# EAGLE schematic CM3+IO Board (EAGLE 9.5.2)
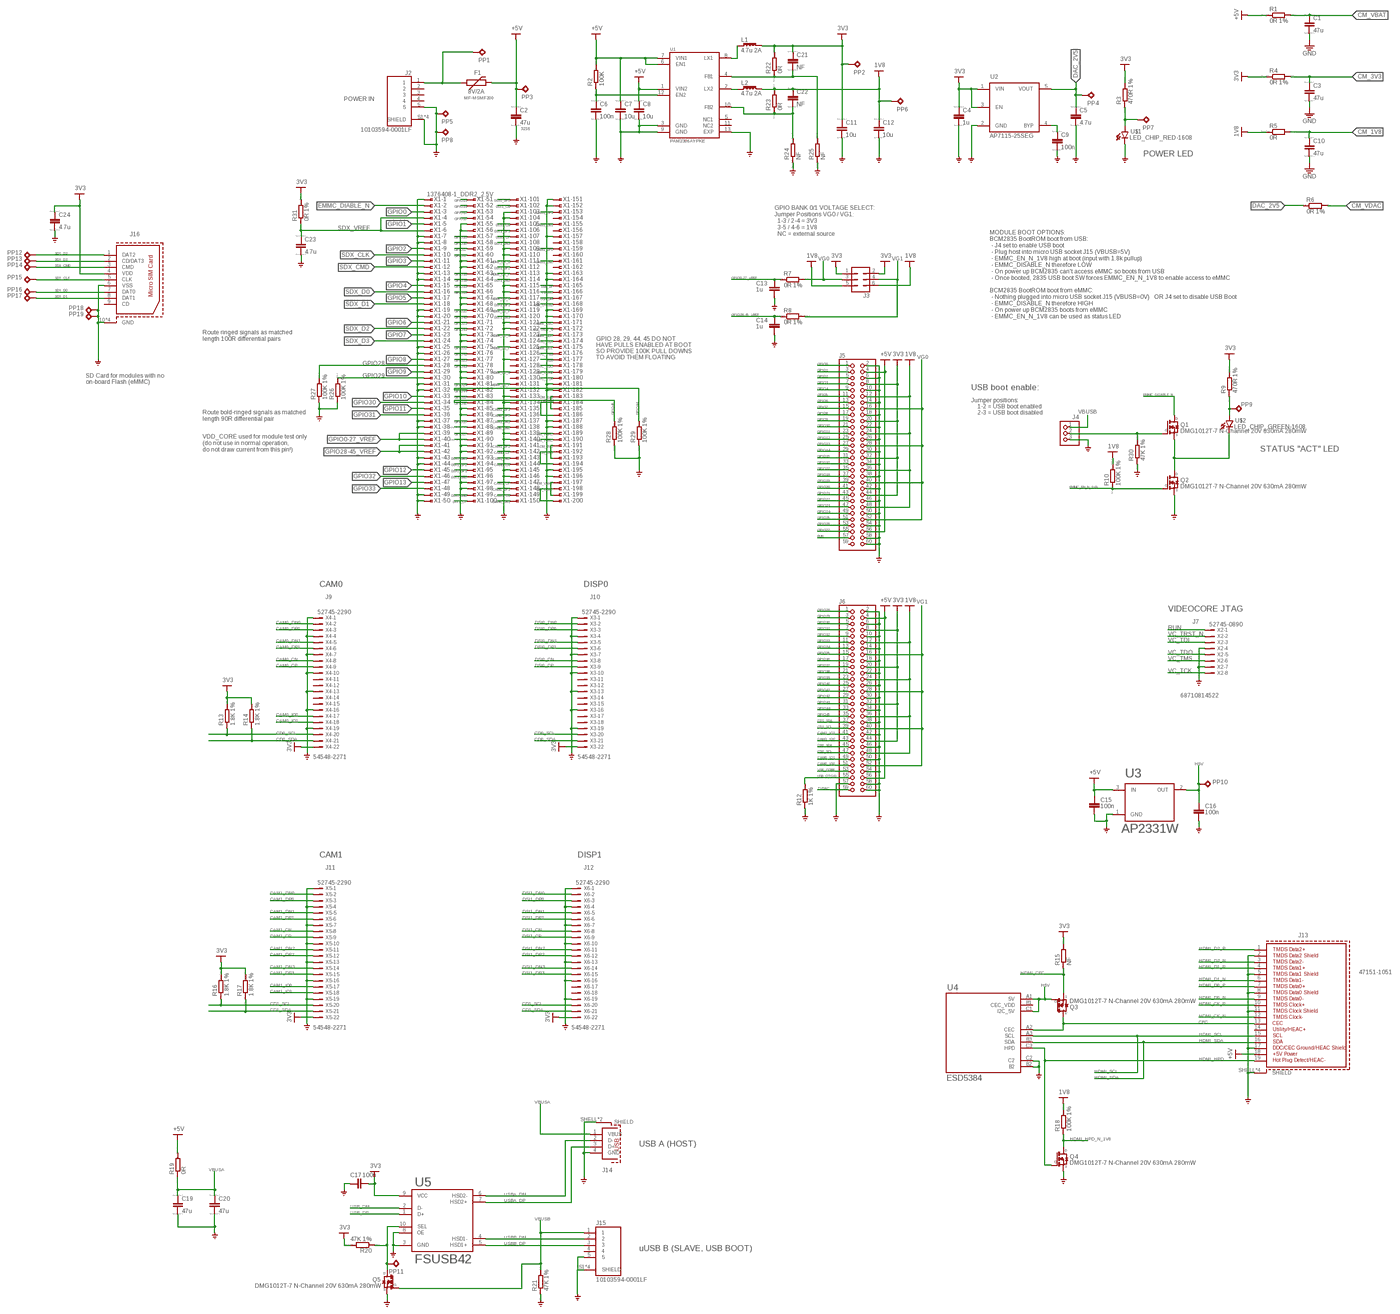
[diagram p0: schematic, sheet 1, overview]
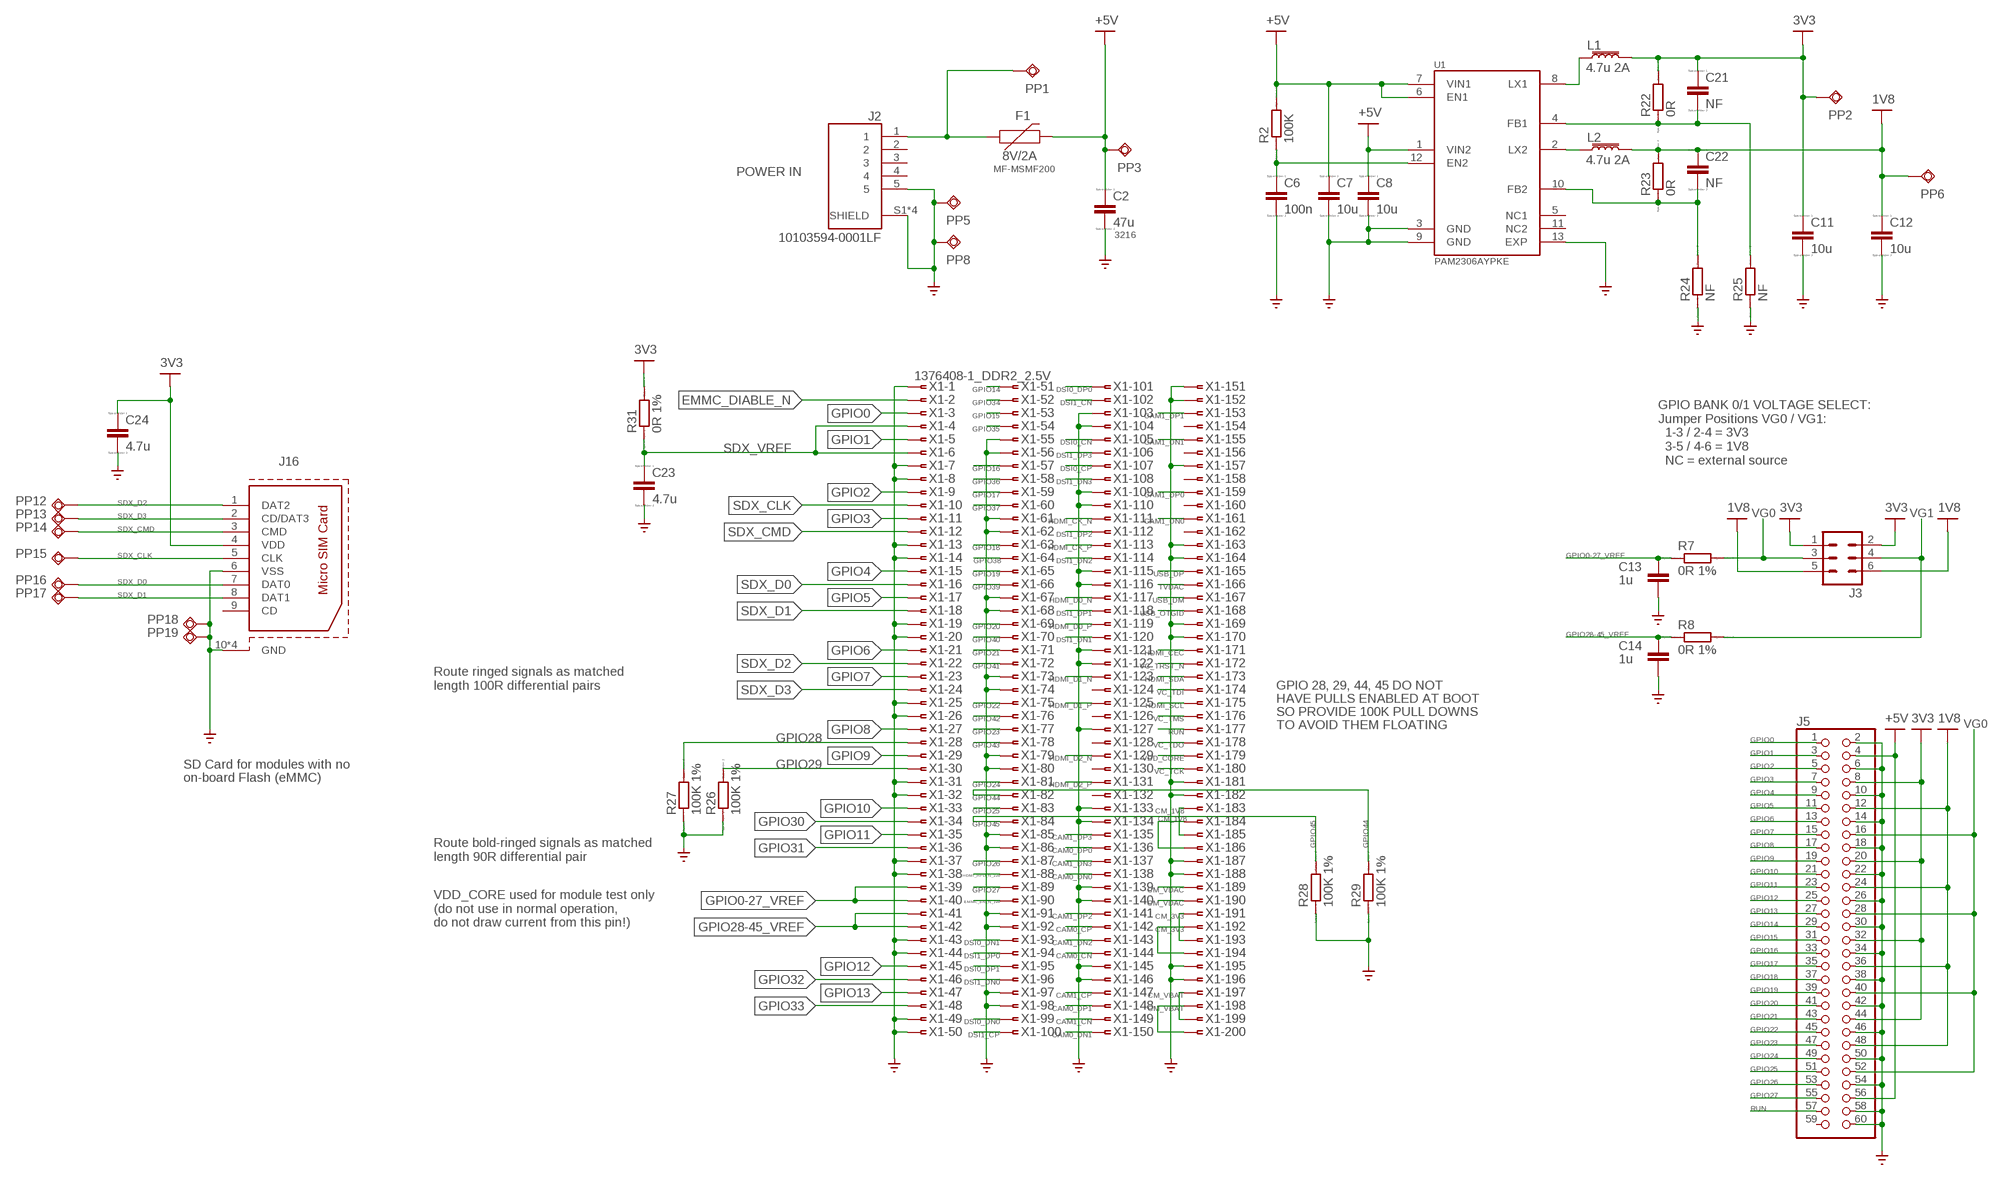
[diagram p1: schematic, sheet 1, part 1 of 4]
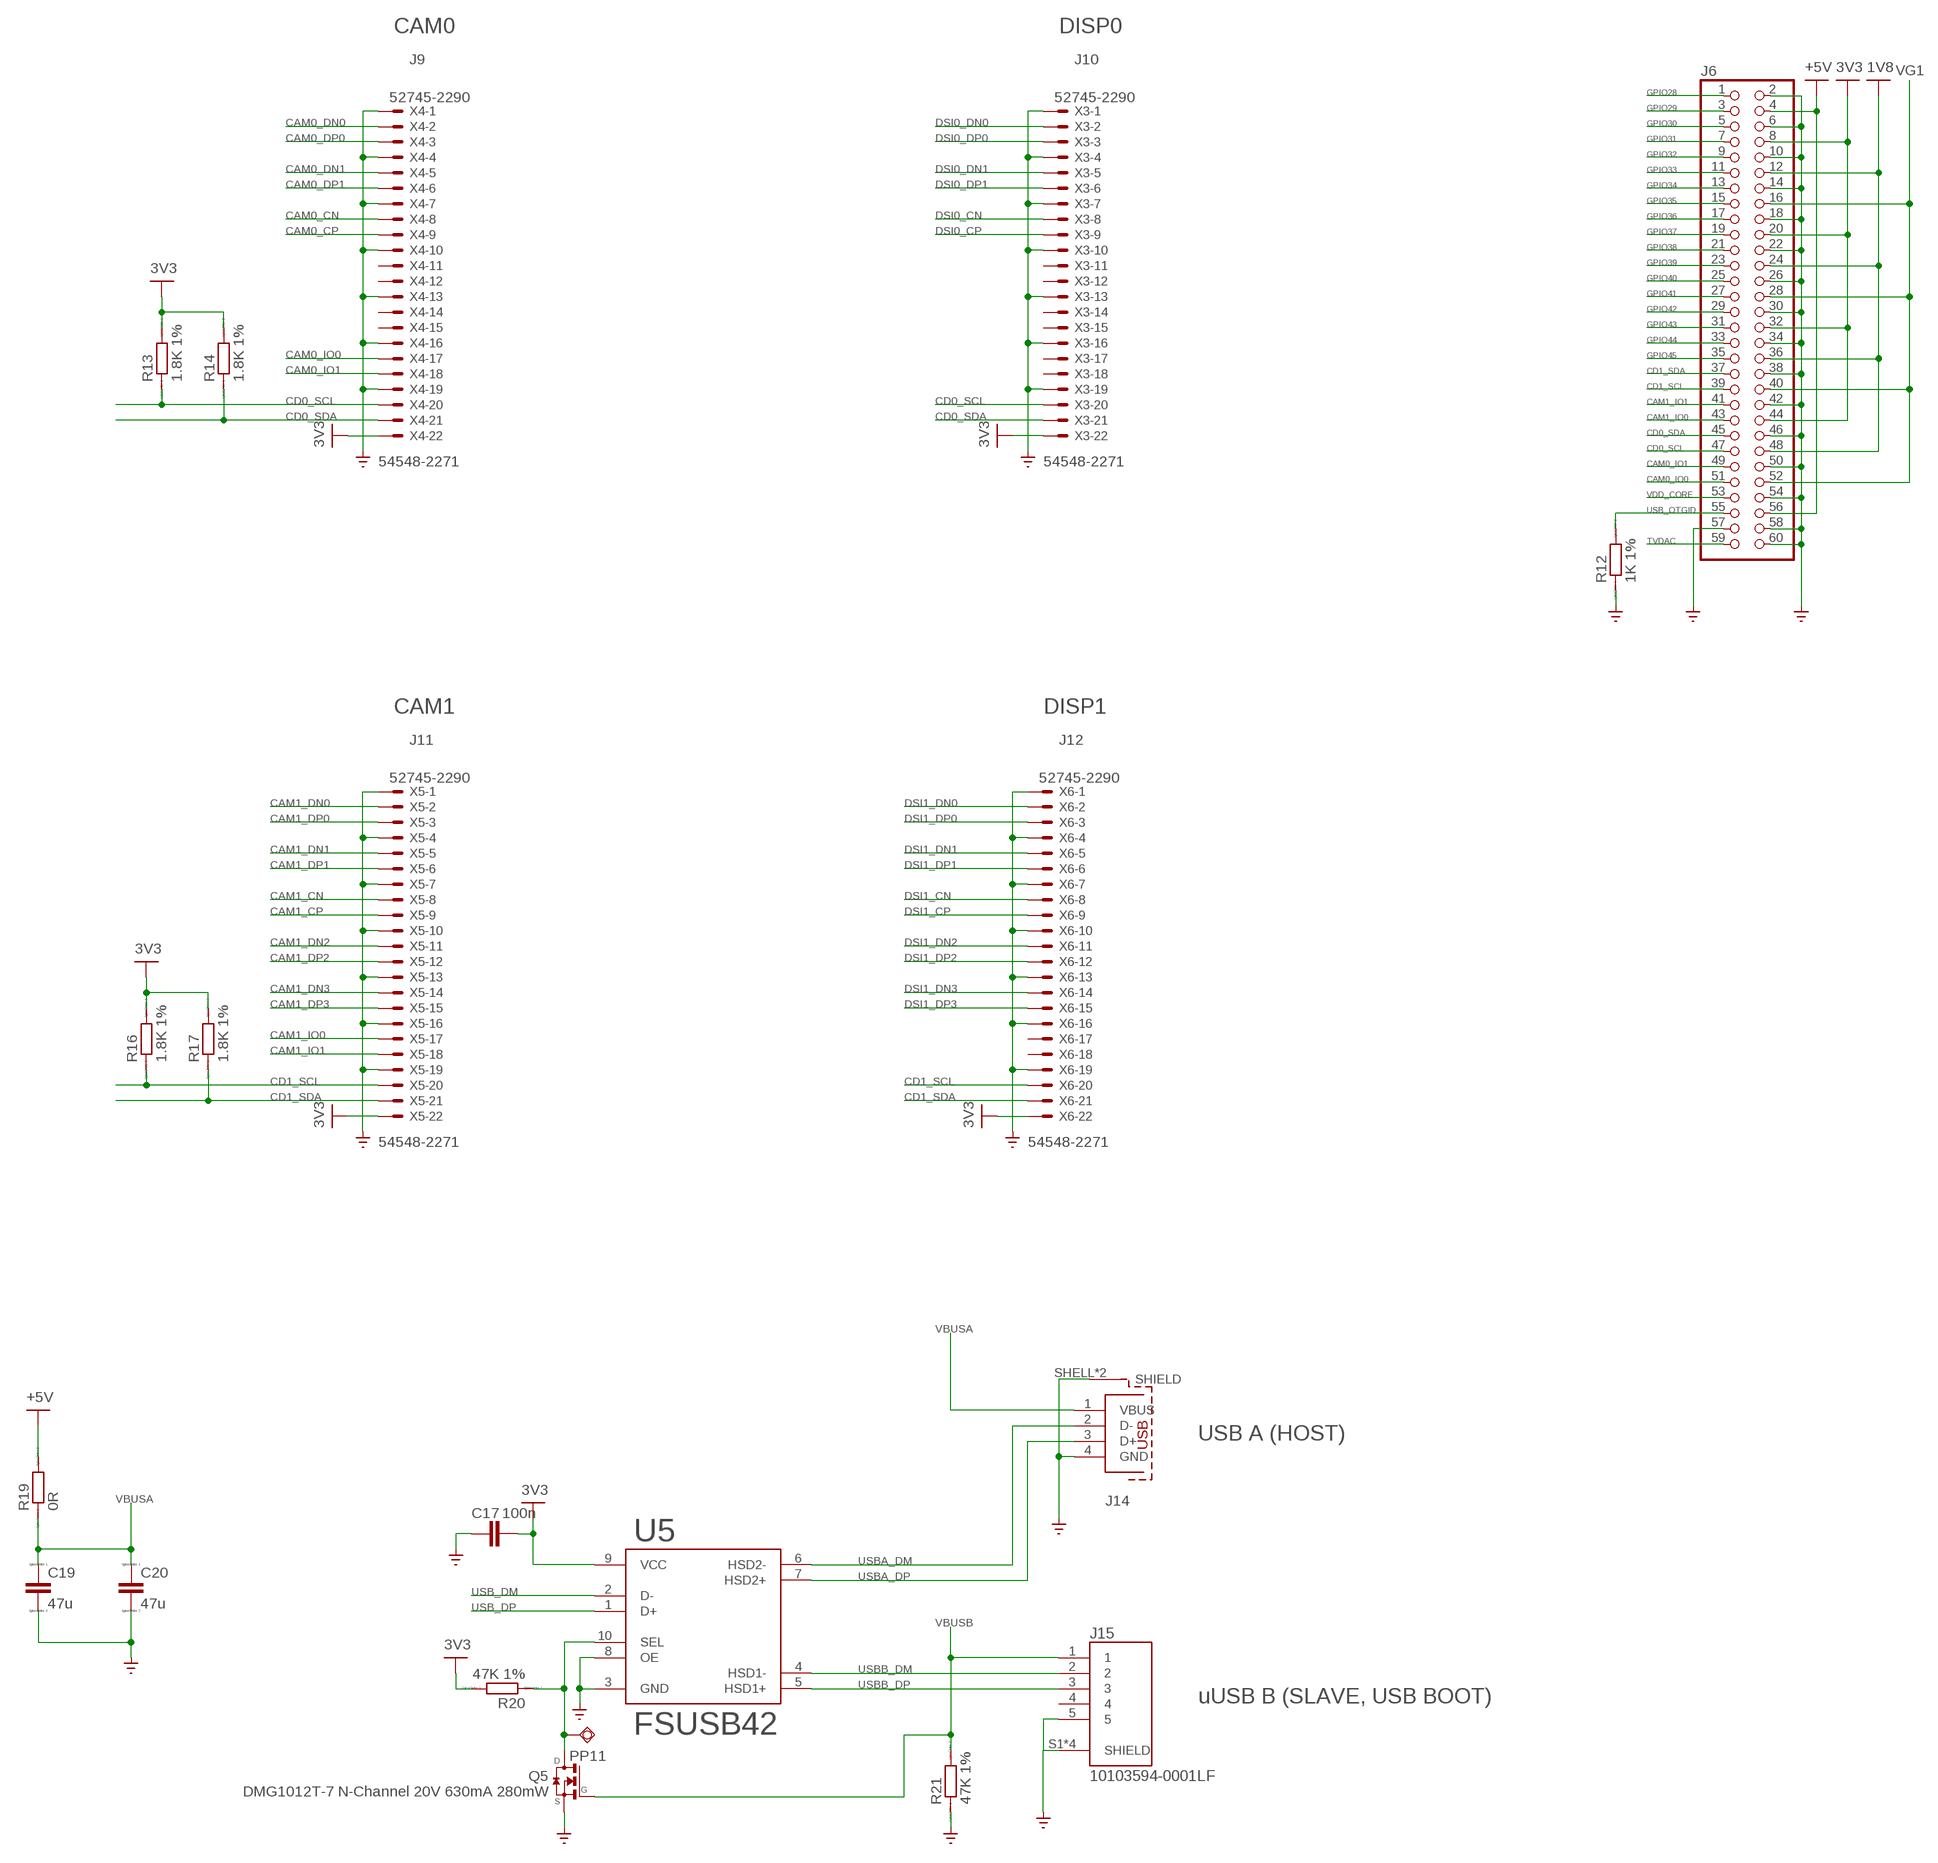
[diagram p2: schematic, sheet 1, part 2 of 4]
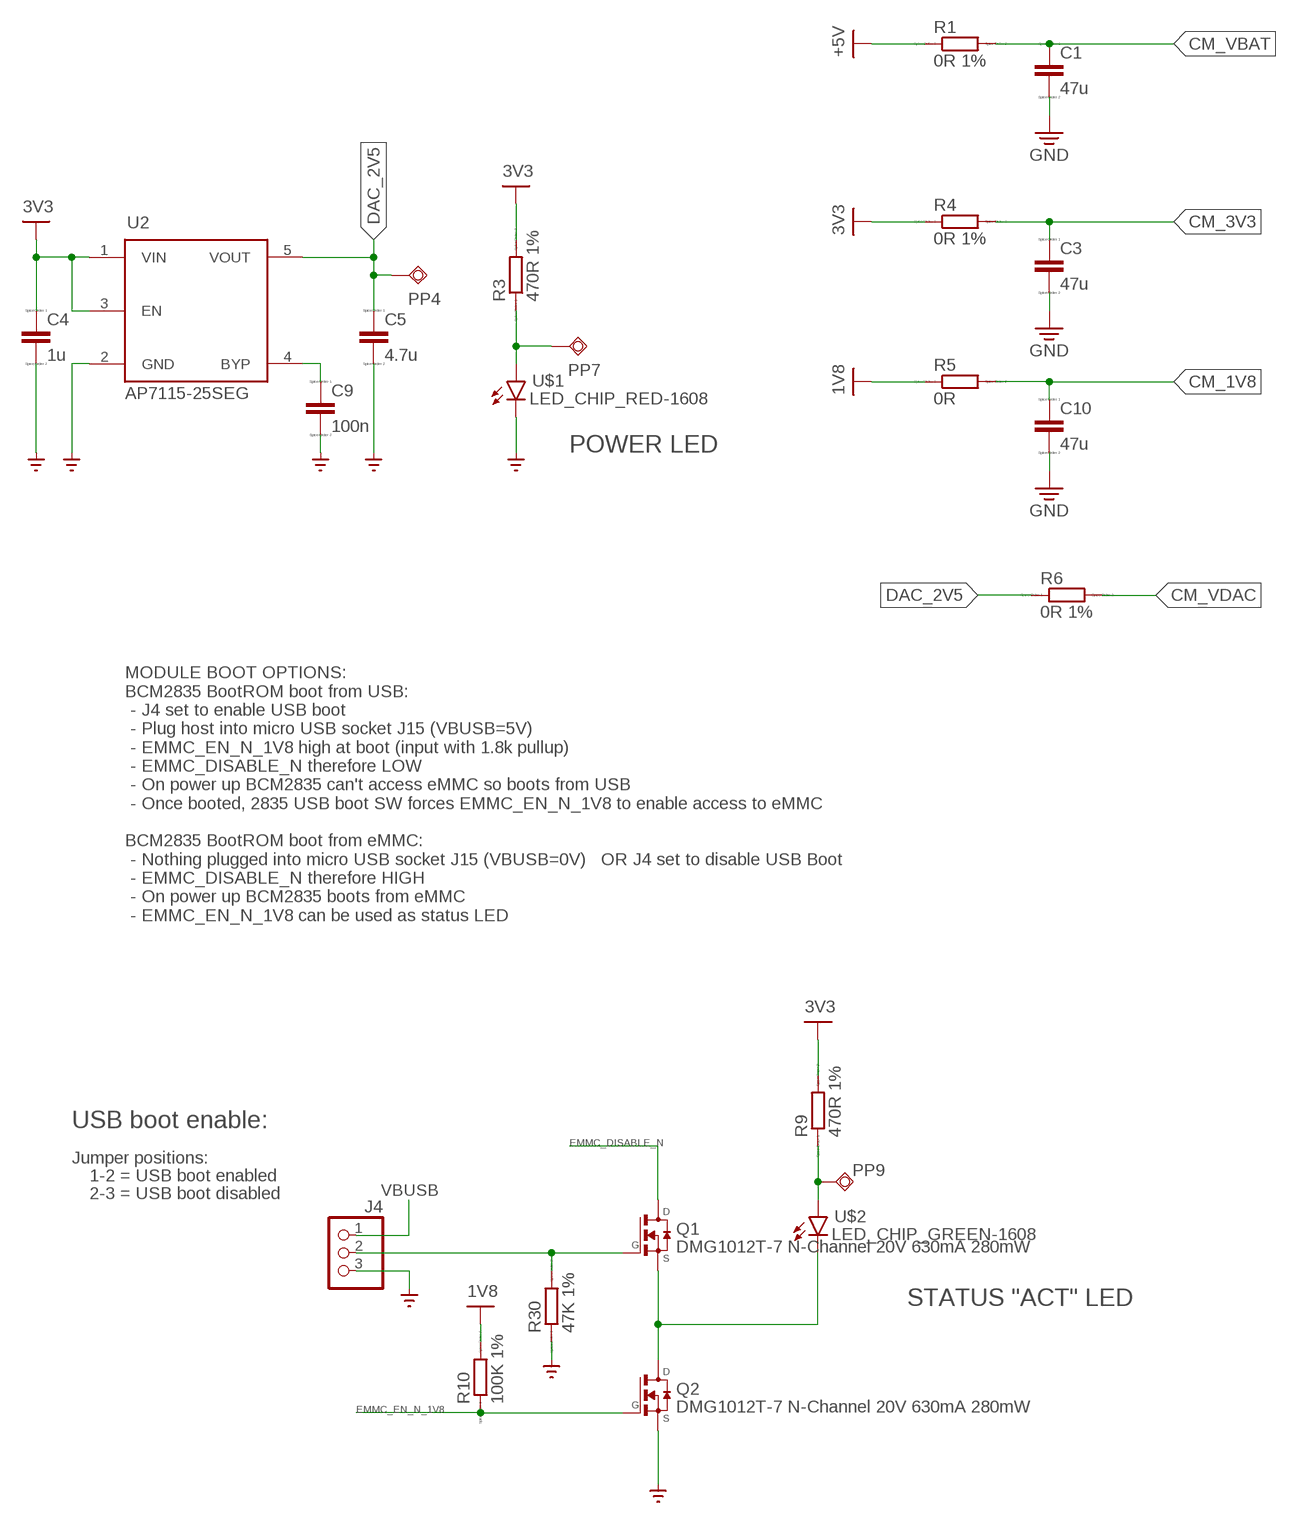
[diagram p3: schematic, sheet 1, part 3 of 4]
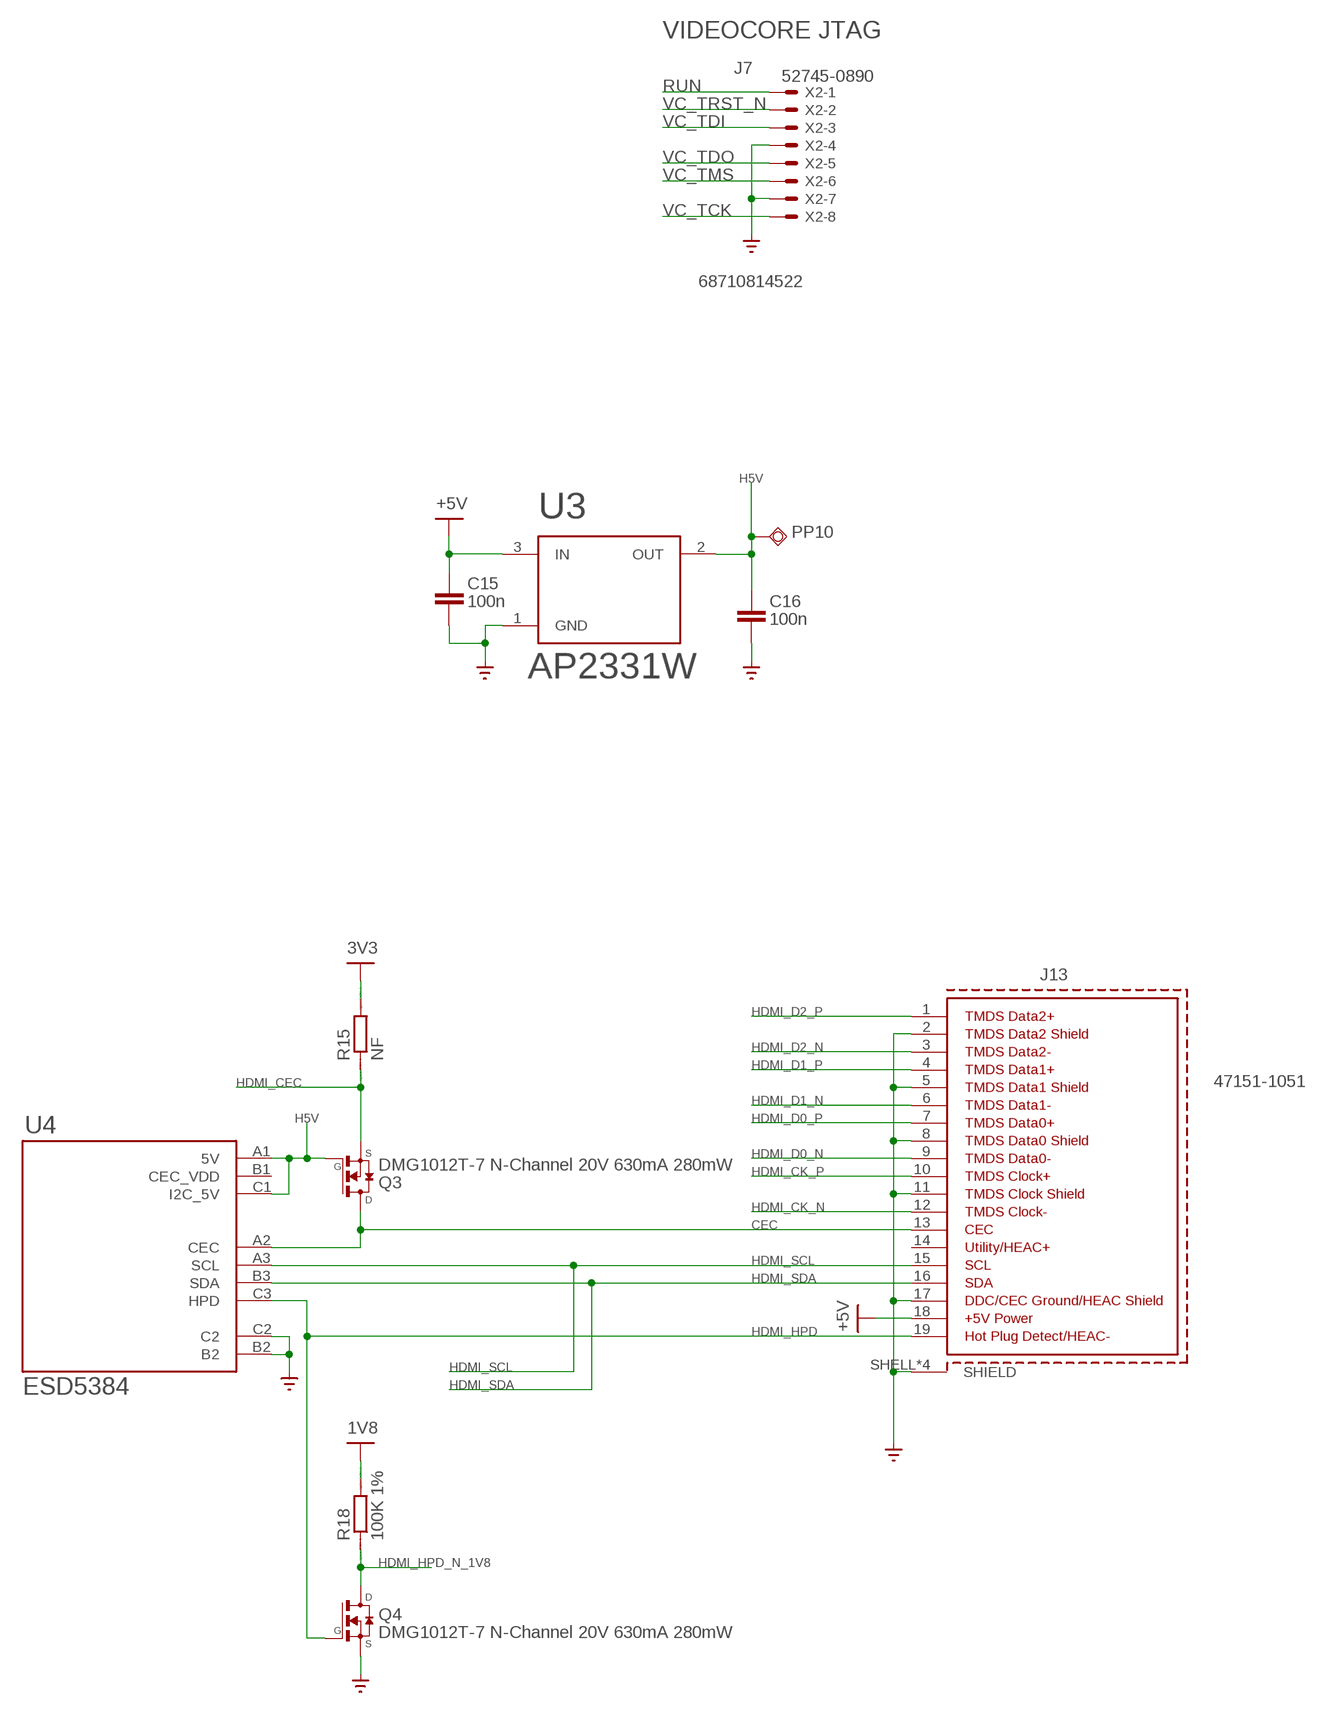
[diagram p4: schematic, sheet 1, part 4 of 4]

## Parts
C1  47u  CC3216  [C3216]
C2  47u  CC3216  [C3216]
C3  47u  CC3216  [C3216]
C4  1u  CC1005  [C1005]
C5  4.7u  CC1608  [C1608]
C6  100n  CC1005  [C1005]
C7  10u  CC2012  [C2012]
C8  10u  CC2012  [C2012]
C9  100n  CC1005  [C1005]
C10  47u  CC3216  [C3216]
C11  10u  CC2012  [C2012]
C12  10u  CC2012  [C2012]
C13  1u  C_CHIP-0402(1005-METRIC)  [CAPC1005X60]
C14  1u  C_CHIP-0402(1005-METRIC)  [CAPC1005X60]
C15  100n  C_CHIP-0402(1005-METRIC)  [CAPC1005X60]
C16  100n  C_CHIP-0402(1005-METRIC)  [CAPC1005X60]
C17  100n  C_CHIP-0402(1005-METRIC)  [CAPC1005X60]
C19  47u  CC3216  [C3216]
C20  47u  CC3216  [C3216]
C21  NF  CC1005  [C1005]
C22  NF  CC1005  [C1005]
C23  4.7u  CC1608  [C1608]
C24  4.7u  CC1608  [C1608]
F1  8V/2A  PPTC_THREE-QUARTER-AMP  [1206]
J2  10103594-0001LF  [10103594-0001LF]
J3  MA03-2  [MA03-2]
J4  PINHD-1X3  [1X03]
J5  PINHD-2X30  [2X30]
J6  PINHD-2X30  [2X30]
J13  685119134923  [685119134923]
J14  61400416021  [61400416021]
J15  10103594-0001LF  [10103594-0001LF]
J16  693071020811  [693071020811]
L1  4.7u 2A  SRN4018-4R7M  [SRN4018-4R7M]
L2  4.7u 2A  SRN4018-4R7M  [SRN4018-4R7M]
PP1  TESTPAD_TPSQB1,27  [TESTPAD_B1,27]
PP2  TESTPAD_TPSQB1,27  [TESTPAD_B1,27]
PP3  TESTPAD_TPSQB1,27  [TESTPAD_B1,27]
PP4  TESTPAD_TPSQB1,27  [TESTPAD_B1,27]
PP5  TESTPAD_TPSQB1,27  [TESTPAD_B1,27]
PP6  TESTPAD_TPSQB1,27  [TESTPAD_B1,27]
PP7  TESTPAD_TPSQB1,27  [TESTPAD_B1,27]
PP8  TESTPAD_TPSQB1,27  [TESTPAD_B1,27]
PP9  TESTPAD_TPSQB1,27  [TESTPAD_B1,27]
PP10  TESTPAD_TPSQB1,27  [TESTPAD_B1,27]
PP11  TESTPAD_TPSQB1,27  [TESTPAD_B1,27]
PP12  TESTPAD_TPSQB1,27  [TESTPAD_B1,27]
PP13  TESTPAD_TPSQB1,27  [TESTPAD_B1,27]
PP14  TESTPAD_TPSQB1,27  [TESTPAD_B1,27]
PP15  TESTPAD_TPSQB1,27  [TESTPAD_B1,27]
PP16  TESTPAD_TPSQB1,27  [TESTPAD_B1,27]
PP17  TESTPAD_TPSQB1,27  [TESTPAD_B1,27]
PP18  TESTPAD_TPSQB1,27  [TESTPAD_B1,27]
PP19  TESTPAD_TPSQB1,27  [TESTPAD_B1,27]
Q1  DMG1012T  [DMG1012T]
Q2  DMG1012T  [DMG1012T]
Q3  DMG1012T  [DMG1012T]
Q4  DMG1012T  [DMG1012T]
Q5  DMG1012T  [DMG1012T]
R1  0R 1%  RR2012  [R2012]
R2  100K  RR1005  [R1005]
R3  470R 1%  RR1005  [R1005]
R4  0R 1%  RR2012  [R2012]
R5  0R  RR2012  [R2012]
R6  0R 1%  RR2012  [R2012]
R7  0R 1%  RR2012  [R2012]
R8  0R 1%  RR2012  [R2012]
R9  470R 1%  RR1005  [R1005]
R10  100K 1%  RR1005  [R1005]
R12  1K 1%  RR1005  [R1005]
R13  1.8K 1%  RR1005  [R1005]
R14  1.8K 1%  RR1005  [R1005]
R15  NF  RR1005  [R1005]
R16  1.8K 1%  RR1005  [R1005]
R17  1.8K 1%  RR1005  [R1005]
R18  100K 1%  RR1005  [R1005]
R19  0R  RR2012  [R2012]
R20  47K 1%  RR1005  [R1005]
R21  47K 1%  RR1005  [R1005]
R22  0R  RR1005  [R1005]
R23  0R  RR1005  [R1005]
R24  NF  RR1005  [R1005]
R25  NF  RR1005  [R1005]
R26  100K 1%  RR1005  [R1005]
R27  100K 1%  RR1005  [R1005]
R28  100K 1%  RR1005  [R1005]
R29  100K 1%  RR1005  [R1005]
R30  47K 1%  RR1005  [R1005]
R31  0R 1%  RR2012  [R2012]
U1  PAM2306AYPKE  [SON45P300X300X80-13N]
U2  AP7115  [AP7115]
U3  AP2331W  [AP2331W]
U4  ESD5384  [ESD5384]
U5  FSUSB42  [FSUSB42UMX]
U$1  LED_CHIP_RED-1608  [LEDC1608X39N_R]
U$2  LED_CHIP_GREEN-1608  [LEDC1608X39N_G]
X1  1376408-1_DDR2_2.5V  [6-1376408-1]
X2  52745-0890  [52745-0890]
X3  52745-2290  [52745-2290]
X4  52745-2290  [52745-2290]
X5  52745-2290  [52745-2290]
X6  52745-2290  [52745-2290]

## Nets
+V: C2.1 C4.1 C7.1 C8.1 C11.1 C12.1 C15.1 C17.2 C21.1 C22.1 C24.1 F1.2 J3.1 J3.2 J3.5 J3.6 J5.4 J5.8 J5.12 J5.20 J5.24 J5.32 J5.36 J5.44 J5.48 J5.56 J6.4 J6.8 J6.12 J6.20 J6.24 J6.32 J6.36 J6.44 J6.48 J6.56 J13.18(+5VPOWER) J16.4(VDD) L1.2 L2.2 PP2.TP PP3.TP PP6.TP R1.1 R2.2 R3.2 R4.1 R5.1 R9.2 R10.2 R13.2 R14.2 R15.2 R16.2 R17.2 R18.2 R19.2 R20.2 R22.2 R23.2 R31.2 U1.1(VIN2) U1.6(EN1) U1.7(VIN1) U2.1(VIN) U2.3(EN) U3.3(IN) U5.9(VCC) X3.22 X4.22 X5.22 X6.22 ; supply symbol labelled 3V3, 1V8, +5V
CAM0_CN: X1.144 X4.8
CAM0_CP: X1.142 X4.9
CAM0_DN0: X1.138 X4.2
CAM0_DN1: X1.150 X4.5
CAM0_DP0: X1.136 X4.3
CAM0_DP1: X1.148 X4.6
CAM0_IO0: J6.51 X4.17
CAM0_IO1: J6.49 X4.18
CAM1_CN: X1.149 X5.8
CAM1_CP: X1.147 X5.9
CAM1_DN0: X1.161 X5.2
CAM1_DN1: X1.155 X5.5
CAM1_DN2: X1.143 X5.11
CAM1_DN3: X1.137 X5.14
CAM1_DP0: X1.159 X5.3
CAM1_DP1: X1.153 X5.6
CAM1_DP2: X1.141 X5.12
CAM1_DP3: X1.135 X5.15
CAM1_IO0: J6.43 X5.17
CAM1_IO1: J6.41 X5.18
CD0_SCL: J6.47 R13.1 X3.20 X4.20
CD0_SDA: J6.45 R14.1 X3.21 X4.21
CD1_SCL: J6.39 R16.1 X5.20 X6.20
CD1_SDA: J6.37 R17.1 X5.21 X6.21
CEC: J13.13(CEC) Q3.D U4.A2(CEC)
CM_1V8: C10.1 R5.2 X1.183 X1.184 X1.185 X1.186
CM_3V3: C3.1 R4.2 X1.191 X1.192 X1.193 X1.194
CM_VBAT: C1.1 R1.2 X1.197 X1.198 X1.199 X1.200
CM_VDAC: R6.2 X1.189 X1.190
DAC_2V5: C5.1 PP4.TP R6.1 U2.5(VOUT)
DSI0_CN: X1.105 X3.8
DSI0_CP: X1.107 X3.9
DSI0_DN0: X1.99 X3.2
DSI0_DN1: X1.93 X3.5
DSI0_DP0: X1.101 X3.3
DSI0_DP1: X1.95 X3.6
DSI1_CN: X1.102 X6.8
DSI1_CP: X1.100 X6.9
DSI1_DN0: X1.96 X6.2
DSI1_DN1: X1.120 X6.5
DSI1_DN2: X1.114 X6.11
DSI1_DN3: X1.108 X6.14
DSI1_DP0: X1.94 X6.3
DSI1_DP1: X1.118 X6.6
DSI1_DP2: X1.112 X6.12
DSI1_DP3: X1.106 X6.15
EMMC_DIABLE_N: X1.2
EMMC_DISABLE_N: Q1.D
EMMC_EN_N_1V8: Q2.G R10.1 X1.90
GND: C1.2 C2.2 C3.2 C4.2 C5.2 C6.2 C7.2 C8.2 C9.2 C10.2 C11.2 C12.2 C13.2 C14.2 C15.2 C16.2 C17.1 C19.2 C20.2 C23.2 C24.2 J2.5 J2.S1(SHIELD) J2.S2(SHIELD) J2.S3(SHIELD) J2.S4(SHIELD) J4.3 J5.2 J5.6 J5.10 J5.14 J5.18 J5.22 J5.26 J5.30 J5.34 J5.38 J5.42 J5.46 J5.50 J5.54 J5.58 J5.60 J6.2 J6.6 J6.10 J6.14 J6.18 J6.22 J6.26 J6.30 J6.34 J6.38 J6.42 J6.46 J6.50 J6.54 J6.57 J6.58 J6.60 J13.2(TMDSDATA2SHIELD) J13.5(TMDSDATA1SHIELD) J13.8(TMDSDATA0SHIELD) J13.11(TMDSCLOCKSHIELD) J13.17(DDC/CEC/HECGROUND) J13.SHELL1(SHIELD) J13.SHELL2(SHIELD) J13.SHELL3(SHIELD) J13.SHELL(SHIELD) J14.4(GND) J14.SHELL1(SHIELD) J14.SHELL(SHIELD) J15.5 J15.S1(SHIELD) J15.S2(SHIELD) J15.S3(SHIELD) J15.S4(SHIELD) J16.6(VSS) J16.10(GND) J16.11(GND) J16.12(GND) J16.13(GND) PP5.TP PP8.TP PP18.TP PP19.TP Q2.S Q4.S Q5.S R12.1 R21.1 R24.1 R25.1 R26.1 R27.1 R28.1 R29.1 R30.1 U1.3(GND) U1.9(GND) U1.13(EXP) U2.2(GND) U3.1(GND) U4.B2 U4.C2 U5.3(GND) U5.8(OE) U$1.2(C) X1.1 X1.7 X1.8 X1.13 X1.14 X1.19 X1.20 X1.25 X1.26 X1.31 X1.32 X1.37 X1.38 X1.43 X1.44 X1.49 X1.50 X1.55 X1.56 X1.61 X1.62 X1.67 X1.68 X1.73 X1.74 X1.79 X1.80 X1.85 X1.86 X1.91 X1.92 X1.97 X1.98 X1.103 X1.104 X1.109 X1.110 X1.115 X1.116 X1.121 X1.122 X1.127 X1.133 X1.134 X1.139 X1.140 X1.145 X1.146 X1.151 X1.152 X1.157 X1.163 X1.164 X1.169 X1.170 X1.181 X1.182 X1.187 X1.188 X1.195 X1.196 X2.4 X2.7 X3.1 X3.4 X3.7 X3.10 X3.13 X3.16 X3.19 X4.1 X4.4 X4.7 X4.10 X4.13 X4.16 X4.19 X5.1 X5.4 X5.7 X5.10 X5.13 X5.16 X5.19 X6.1 X6.4 X6.7 X6.10 X6.13 X6.16 X6.19 ; supply symbol labelled SUPPLY0_GND_
GPIO0: J5.1 X1.3
GPIO0-27_VREF: C13.1 R7.1 X1.39 X1.40
GPIO1: J5.3 X1.5
GPIO2: J5.5 X1.9
GPIO3: J5.7 X1.11
GPIO4: J5.9 X1.15
GPIO5: J5.11 X1.17
GPIO6: J5.13 X1.21
GPIO7: J5.15 X1.23
GPIO8: J5.17 X1.27
GPIO9: J5.19 X1.29
GPIO10: J5.21 X1.33
GPIO11: J5.23 X1.35
GPIO12: J5.25 X1.45
GPIO13: J5.27 X1.47
GPIO14: J5.29 X1.51
GPIO15: J5.31 X1.53
GPIO16: J5.33 X1.57
GPIO17: J5.35 X1.59
GPIO18: J5.37 X1.63
GPIO19: J5.39 X1.65
GPIO20: J5.41 X1.69
GPIO21: J5.43 X1.71
GPIO22: J5.45 X1.75
GPIO23: J5.47 X1.77
GPIO24: J5.49 X1.81
GPIO25: J5.51 X1.83
GPIO26: J5.53 X1.87
GPIO27: J5.55 X1.89
GPIO28: J6.1 R27.2 X1.28
GPIO28-45_VREF: C14.1 R8.1 X1.41 X1.42
GPIO29: J6.3 R26.2 X1.30
GPIO30: J6.5 X1.34
GPIO31: J6.7 X1.36
GPIO32: J6.9 X1.46
GPIO33: J6.11 X1.48
GPIO34: J6.13 X1.52
GPIO35: J6.15 X1.54
GPIO36: J6.17 X1.58
GPIO37: J6.19 X1.60
GPIO38: J6.21 X1.64
GPIO39: J6.23 X1.66
GPIO40: J6.25 X1.70
GPIO41: J6.27 X1.72
GPIO42: J6.29 X1.76
GPIO43: J6.31 X1.78
GPIO44: J6.33 R29.2 X1.82
GPIO45: J6.35 R28.2 X1.84
H5V: C16.1 PP10.TP Q3.G U3.2(OUT) U4.A1(5V) U4.C1(I2C_5V)
HDMI_CEC: Q3.S R15.1 X1.171
HDMI_CK_N: J13.12(TMDSCLOCK-) X1.111
HDMI_CK_P: J13.10(TMDSCLOCK+) X1.113
HDMI_D0_N: J13.9(TMDSDATA0-) X1.117
HDMI_D0_P: J13.7(TMDSDATA0+) X1.119
HDMI_D1_N: J13.6(TMDSDATA1-) X1.123
HDMI_D1_P: J13.4(TMDSDATA1+) X1.125
HDMI_D2_N: J13.3(TMDSDATA2-) X1.129
HDMI_D2_P: J13.1(TMDSDATA2+) X1.131
HDMI_HPD: J13.19(HOTPLUGDETECT/HEAC-) Q4.G U4.C3(HPD)
HDMI_HPD_N_1V8: Q4.D R18.1 X1.88
HDMI_SCL: J13.15(SCL) U4.A3(SCL) X1.175
HDMI_SDA: J13.16(SDA) U4.B3(SDA) X1.173
N$1: F1.1 J2.1 PP1.TP
N$2: C21.2 R22.1 R25.2 U1.4(FB1)
N$3: C6.1 R2.1 U1.12(EN2)
N$4: PP7.TP R3.1 U$1.1(A)
N$5: C9.1 U2.4(BYP)
N$6: L1.1 U1.8(LX1)
N$7: J4.2 Q1.G R30.2
N$8: L2.1 U1.2(LX2)
N$9: Q1.S Q2.D U$2.2(C)
N$11: C22.2 R23.1 R24.2 U1.10(FB2)
N$13: PP9.TP R9.1 U$2.1(A)
N$14: PP11.TP Q5.D R20.1 U5.10(SEL)
RUN: J5.57 X1.177 X2.1
SDX_CLK: J16.5(CLK) PP15.TP X1.10
SDX_CMD: J16.3(CMD) PP14.TP X1.12
SDX_D0: J16.7(DAT0) PP16.TP X1.16
SDX_D1: J16.8(DAT1) PP17.TP X1.18
SDX_D2: J16.1(DAT2) PP12.TP X1.22
SDX_D3: J16.2(CD/DAT3) PP13.TP X1.24
SDX_VREF: C23.1 R31.1 X1.4 X1.6
TVDAC: J6.59 X1.166
USB_DM: U5.2(D-) X1.167
USB_DP: U5.1(D+) X1.165
USB_OTGID: J6.55 R12.2 X1.168
USBA_DM: J14.2(D-) U5.6(HSD2-)
USBA_DP: J14.3(D+) U5.7(HSD2+)
USBB_DM: J15.2 U5.4(HSD1-)
USBB_DP: J15.3 U5.5(HSD1+)
VBUSA: C19.1 C20.1 J14.1(VBUS) R19.1
VBUSB: J4.1 J15.1 Q5.G R21.2
VC_TCK: X1.180 X2.8
VC_TDI: X1.174 X2.3
VC_TDO: X1.178 X2.5
VC_TMS: X1.176 X2.6
VC_TRST_N: X1.172 X2.2
VDD_CORE: J6.53 X1.179
VG0: J3.3 J5.16 J5.28 J5.40 J5.52 R7.2
VG1: J3.4 J6.16 J6.28 J6.40 J6.52 R8.2
Unconnected: J2.2 J2.3 J2.4 J5.59 J13.14(UTILITY/HEAC+) J15.4 J16.9(CD) U1.5(NC1) U1.11(NC2) U4.B1(CEC_VDD) X1.124 X1.126 X1.128 X1.130 X1.132 X1.154 X1.156 X1.158 X1.160 X1.162 X3.11 X3.12 X3.14 X3.15 X3.17 X3.18 X4.11 X4.12 X4.14 X4.15 X6.17 X6.18

## Notes on the sheet
- MF-MSMF200
- POWER IN
- 3216
- POWER LED
- GPIO BANK 0/1 VOLTAGE SELECT:
  Jumper Positions VG0 / VG1:
    1-3 / 2-4 = 3V3
    3-5 / 4-6 = 1V8
    NC = external source
- MODULE BOOT OPTIONS:
  BCM2835 BootROM boot from USB:
   - J4 set to enable USB boot
   - Plug host into micro USB socket J15 (VBUSB=5V)
   - EMMC_EN_N_1V8 high at boot (input with 1.8k pullup)
   - EMMC_DISABLE_N therefore LOW
   - On power up BCM2835 can't access eMMC so boots from USB
   - Once booted, 2835 USB boot SW forces EMMC_EN_N_1V8 to enable access to eMMC
  
  BCM2835 BootROM boot from eMMC:
   - Nothing plugged into micro USB socket J15 (VBUSB=0V)   OR J4 set to disable USB Boot
   - EMMC_DISABLE_N therefore HIGH
   - On power up BCM2835 boots from eMMC
   - EMMC_EN_N_1V8 can be used as status LED
- Route ringed signals as matched
  length 100R differential pairs
- GPIO 28, 29, 44, 45 DO NOT
- HAVE PULLS ENABLED AT BOOT
- SO PROVIDE 100K PULL DOWNS
- TO AVOID THEM FLOATING
- SD Card for modules with no
- on-board Flash (eMMC)
- USB boot enable:
- Jumper positions:
- 1-2 = USB boot enabled
- 2-3 = USB boot disabled
- Route bold-ringed signals as matched
  length 90R differential pair
- VDD_CORE used for module test only
  (do not use in normal operation,
  do not draw current from this pin!)
- STATUS "ACT" LED
- CAM0 | DISP0
- J9 | J10
- VIDEOCORE JTAG
- J7
- 68710814522
- 54548-2271 | 54548-2271
- CAM1 | DISP1
- J11 | J12
- 47151-1051
- 54548-2271 | 54548-2271
- USB A (HOST)
- uUSB B (SLAVE, USB BOOT)

## Library data of the parts
C1-C12 C19-C24 = eagle-ltspice:C: CAPACITOR, European symbol; SPICEMODEL: NONE; SPICEPREFIX: C
C13-C17 = Tutorial - Fusion 360:C: Capacitor - Generic; CATEGORY: Capacitor
F1 = SparkFun-Fuses:PPTC: Resettable Fuse PPTC Resettable Fuse. Really a sort of resistor with a polymeric positive temperature coefficient whose resistance increases dramatically with an increase in temperature. When heated by the power passing through the resistance rises causing the current to be limited, protecting the circuit. This is achieved by the transition of the polymer from a crystalline to an amorphous state where the conductive carbon separates breaking the conductive pathways found in the cool crystalline structure. When a PPTC cools back down it resumes conducting letting the circuit turn back on. SparkFun Products: SparkFun RedBoard - Programmed with Arduino <https://www.sparkfun.com/products/12757> Pro Micro - 5V/16MHz <https://www.sparkfun.com/products/12640> Arduino Pro 328 - 5V/16MHz <https://www.sparkfun.com/products/10915> MP3 Trigger <https://www.sparkfun.com/products/13720>; PROD_ID: RES-11150; VALUE: 6V/0.75A
J2 J15 = Connectors:10103594-0001LF: CONN RCPT USB2.0 MICRO B SMD R/A Manufacturer's datasheet <https://cdn.amphenol-icc.com/media/wysiwyg/files/drawing/10103594.pdf>; CREATED_BY: PCBLayout.com; DIGIKEY_PART_NUMBER: 609-4050-2-ND; MANUFACTURER: Amphenol ICC (FCI); MPN: 10103594-0001LF
J3 = con-lstb:MA03-2: PIN HEADER; OC_FARNELL: unknown; OC_NEWARK: unknown
J4 = pinhead:PINHD-1X3: PIN HEADER
J5 J6 = pinhead:PINHD-2X30: PIN HEADER
J13 = Wurth_Connectors_WR-HDMI:685119134923: WR-COM HDMI SMT Horizontal <https://www.we-online.com/catalog/media/o33015v209%20Family_WR-COM_685119134923.jpg> Details see: https://www.we-online.com/catalog/en/COM_SMT_HORIZONTAL/ Updated by Ella Wu 2020-01-16 2020(C) Würth Elektronik; DATASHEET-URL: https://www.we-online.com/catalog/datasheet/685119134923.pdf; GERDER: Receptacle; MOUNT: SMT; PART-NUMBER: 685119134923; PINS: 19; RATED-CURRENT: 0.5A; TYPE: Horizontal; WORKING-VOLTAGE: 40VDC
J14 = Wurth_Elektronik_Electromechanic_Input-Output_Connectors_rev19d:61400416021: WR-COM Horizontal USB Type A=>Code :Con_I-O_COM_USB_2.0_A_61400416021 <http://katalog.we-online.de/media/images/eican/Con_I-O_COM_USB_2.0_A_61400416021_pf2.jpg> Details see: http://katalog.we-online.de/en/em/614_004_160_21 Created 2014-07-09, Karrer Zheng 2014 (C) Würth Elektronik
J16 = Wurth_Elektronik_Electromechanic_Input-Output_Connectors_rev19d:693071020811: WR-CRD Micro SD Card Connector Push & Push 8 pins KIND PROPERTIES Quality Class 10 000 Mating cycles Gender Socket Type Push & Push MATERIAL PROPERTIES Insulator Material LCP Insulator Flammability Rating UL94 V-0 Insulator Color Black Color Black Cover Material Stainless Steel Contact Material Copper Alloy Contact Plating Selective Gold;​ 1 u' on contact area Contact Type Stamped GENERAL INFORMATION Operating Temperature -25 up to +85 °C;​ -40 up to +85 °C Compliance RoHS ELECTRICAL PROPERTIES Working Voltage 100 V (AC);​ 30 V (AC) Withstanding Voltage 500 V (AC) Contact Resistance 100 mΩ Contact Resistance 500 mΩ Details see: https://katalog.we-online.com/en/em/CRD_SD_MICRO_PUSH_AND_PULL_8_PINS Created by Ella Wu 2019-11-05 2019(C) Wurth Elektronik
L1 L2 = My Library:SRN4018-4R7M: SRN4018 Series - Semi-shielded Power Inductors DATASHEET <http://www.farnell.com/datasheets/1880803.pdf>
PP1-PP19 = BeagleBone_Blue_R3:TESTPAD_TPSQ: Test pad
Q1-Q5 = My Library:DMG1012T: DMG1012T-7DICT-ND DMG1012T MOSFET N-CH 20V 630MA SOT-523 N-Channel 20V 630mA (Ta) 280mW (Ta) Surface Mount SOT-523
R1-R10 R12-R31 = eagle-ltspice:R: RESISTOR, European symbol; SPICEMODEL: NONE; SPICEPREFIX: R
U1 = PAM2306AYPKE(NEW):PAM2306AYPKE: PAM2306 Series 5.5V 1A Dual High Efficiency PWM Step Down DC-DC Converter-WDFN12; AVAILABILITY: Unavailable; DESCRIPTION: Buck Switching Regulator IC Positive Fixed 1.8V, 3.3V 2 Output 1A 12-WFDFN Exposed Pad; MF: Diodes Inc.; MP: PAM2306AYPKE; PACKAGE: WFDFN-12 Diodes Inc.; PRICE: None
U2 = My Library:AP7115: AP7115-25SEG-7 (SOT353) DATASHEET <https://www.diodes.com/assets/Datasheets/AP7115.pdf> The AP7115 is a 150mA, fixed output voltage, low dropout linear regulator. The device includes pass element, error amplifier, band gap reference, current-limit and thermal shutdown circuit. The characteristics of low dropout voltage and low quiescent current make it suitable for use in battery powered devices. The typical quiescent current is approximately 50µA. Several fixed output voltages are available from 1.0V to 3.5V. Additional protection is provided with built-in current-limit and thermal-shutdown function
U3 = My Library:AP2331W: AP2331W DATASHEET <https://www.diodes.com/assets/Datasheets/AP2331.pdf> The AP2331 is a single channel current-limited integrated high-side power switcher optimized for hot-swap applications. The devices have fast short-circuit response time for improved overall system robustness and provide a complete protection solution for application subject to heavy capacitive loads and the prospect of short circuit. It offers reverse-current blocking, over-current, over-temperature and shortcircuit protection, as well as controlled rise time and under-voltage lockout functionality. Footprint: SOT23 / SC59
U4 = My Library:ESD5384
U5 = My Library:FSUSB42: FSUSB42 — Low-Power, Two-Port, High-Speed, USB2.0 (480Mbps) UART Switch DATASHEET <https://www.onsemi.com/pub/Collateral/FSUSB42-D.PDF> The FSUSB42 is a bi-directional, low -power, two-port, high-speed, USB2.0 switch. Configured as a doublepole, double-throw switch (DPDT) switch, it is optimized for switching between any combination of high-speed (480 Mbps) or Full-Speed (12 Mbps) sources.
U$1 = Opto-Electronic:LED_CHIP: LED - Generic; CATEGORY: Opto-Electronic; COLOR: Red; SUB-CATEGORY: LED
U$2 = Opto-Electronic:LED_CHIP: LED - Generic; CATEGORY: Opto-Electronic; COLOR: Green; SUB-CATEGORY: LED
X1 = con-amp:1376408: DDR1 & DDR2 SODIMM SOCKET 0.6mm Pitch 200 Pos. Standard Profile, Standard Type (used on Kontron X-Board) Source: http://catalog.tycoelectronics.com .. JPN_CD_1376408_S.pdf
X2 = con-molex:52745-0890: FFC/FPC-to-Board 0.50mm (.020") SMT Top Contact Right Angle, ZIF, Style Receptacle 52745 / 52435 Source: http://www.molex.com/product/ffc/52745.html; MF: MOLEX; MPN: 52745-0890; OC_FARNELL: unknown; OC_NEWARK: 92M6377
X3-X6 = con-molex:52745-2290: FFC/FPC-to-Board 0.50mm (.020") SMT Top Contact Right Angle, ZIF, Style Receptacle 52745 / 52435 Source: http://www.molex.com/product/ffc/52745.html; MF: MOLEX; OC_FARNELL: unknown; OC_NEWARK: unknown

## Module SOT23
Ports: 

### Library data of the parts